# EAGLE design servo_1 (EAGLE 6.4)
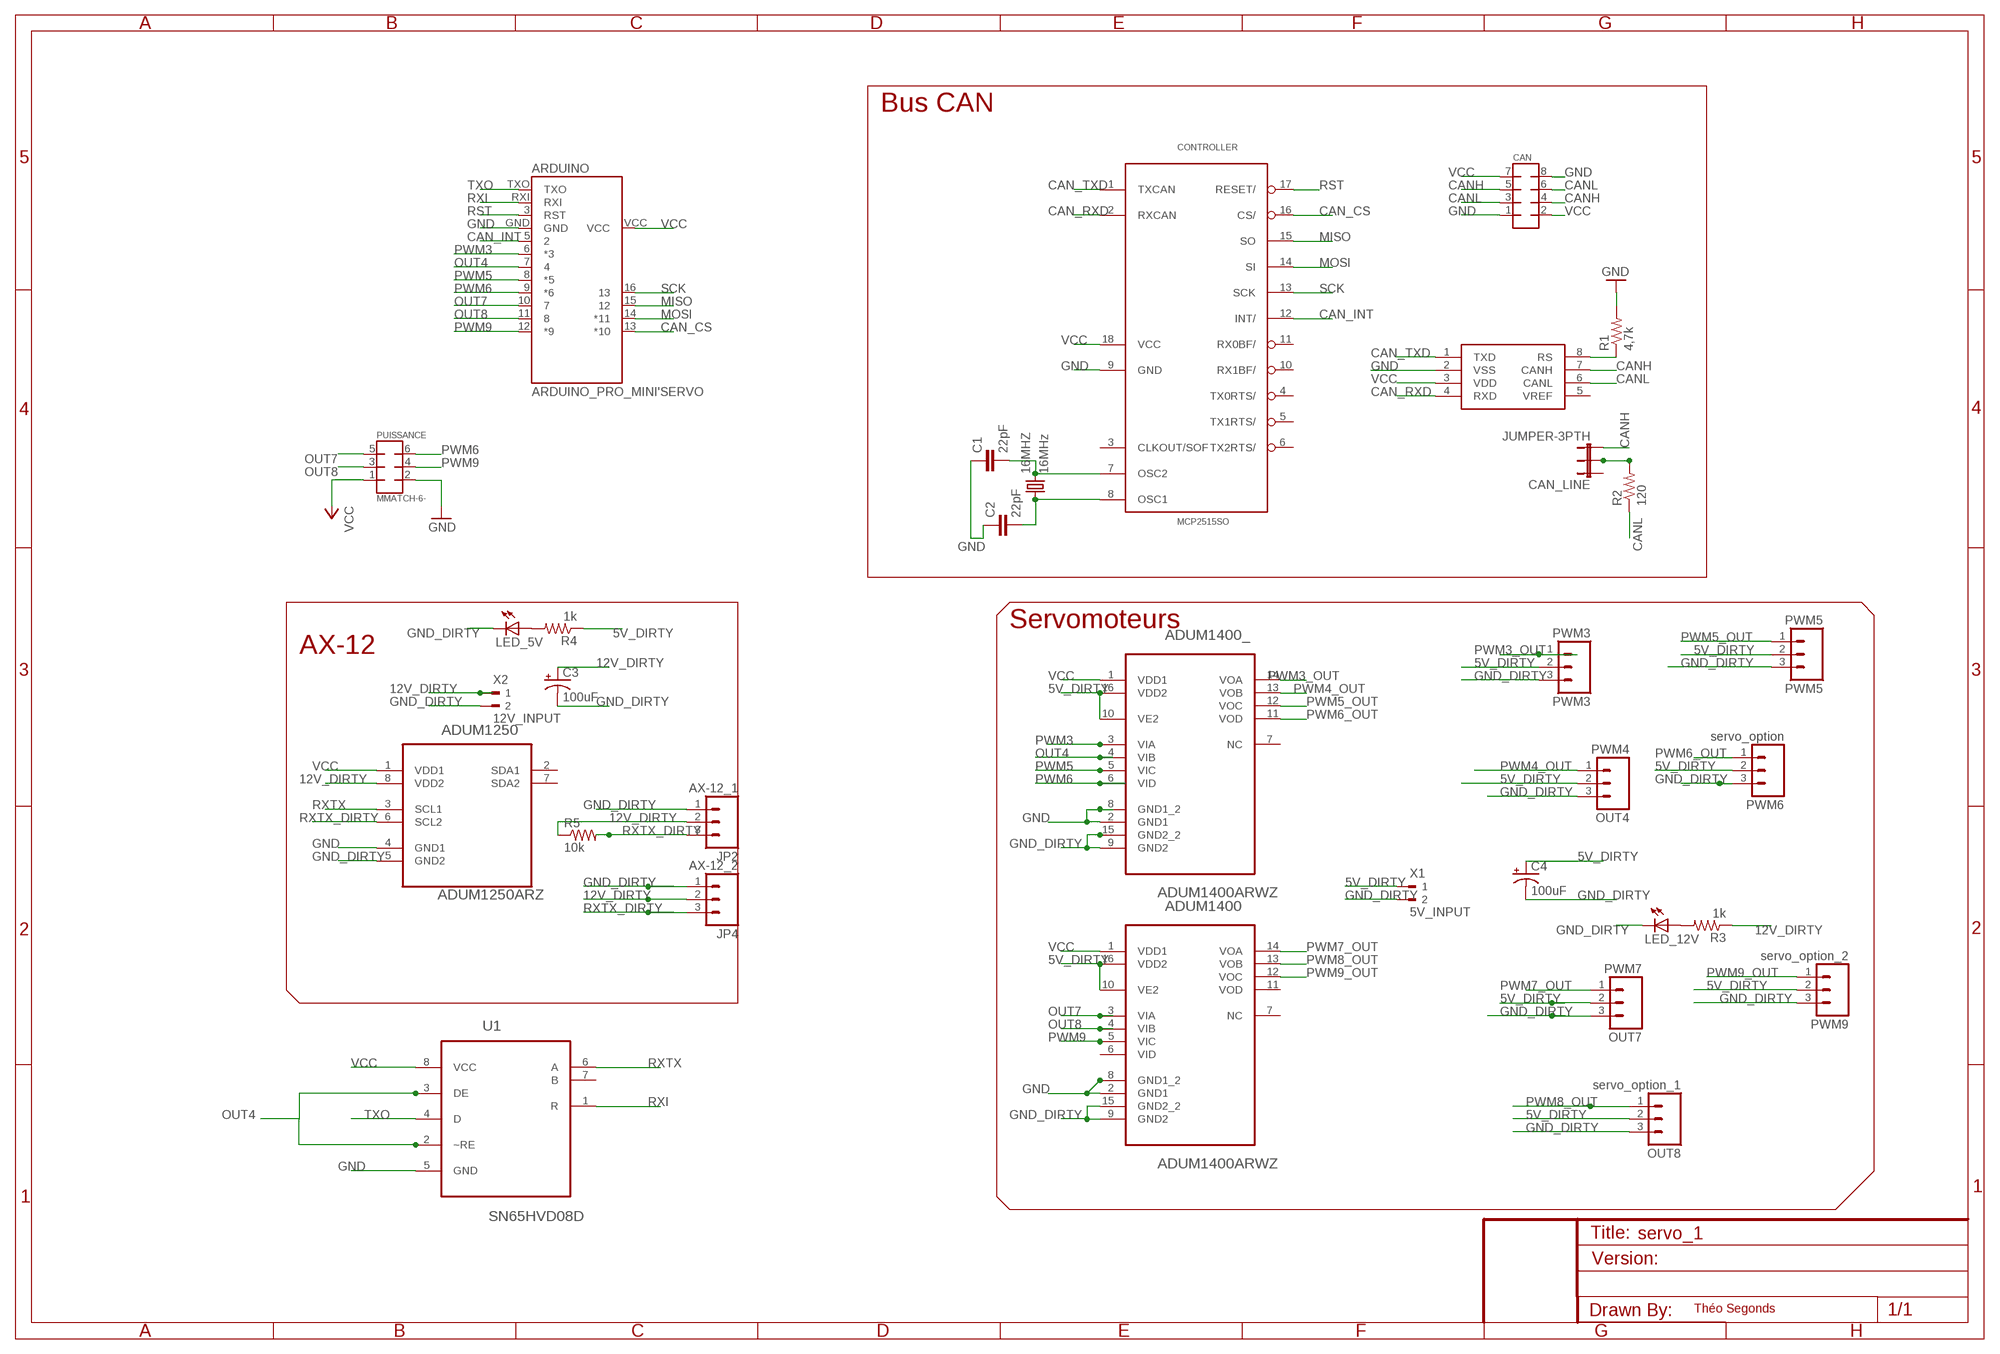
[diagram p0: schematic, sheet 1]

## Parts
16MHZ  16MHz  CRYSTALHC49S  [HC49/S]
ADUM1250  ADUM1250ARZ  [SOIC127P600X175-8N]
ADUM1400  ADUM1400ARWZ  [SOIC127P1032X265-16N]
ADUM1400_  ADUM1400ARWZ  [SOIC127P1032X265-16N]
ARDUINO  ARDUINO_PRO_MINI'SERVO  [ARDUINO_PRO_MINI]
C1  22pF  CAP0805  [0805]
C2  22pF  CAP0805  [0805]
C3  100uF  CAP_POLPTH1  [CPOL-RADIAL-100UF-25V]
C4  100uF  CAP_POLPTH1  [CPOL-RADIAL-100UF-25V]
CAN  MMATCH-8-PTH  [AMP-215079-8]
CAN_LINE  JUMPER-3PTH  [1X03]
CONTROLLER  MCP2515SO  [SO18L]
JP2  AX-12_1  M03POLAR  [MOLEX-1X3]
JP4  AX-12_2  M03POLAR  [MOLEX-1X3]
LED_5V  LEDCHIPLED_0805  [CHIPLED_0805]
LED_12V  LEDCHIPLED_0805  [CHIPLED_0805]
OUT4  PWM4  M03PTH  [1X03]
OUT7  PWM7  M03PTH  [1X03]
OUT8  servo_option_1  M03PTH  [1X03]
PUISSANCE  MMATCH-6-  [AMP-215079-6]
PWM3  PWM3  M03PTH  [1X03]
PWM5  PWM5  M03PTH  [1X03]
PWM6  servo_option  M03PTH  [1X03]
PWM9  servo_option_2  M03PTH  [1X03]
R1  4,7k  RESISTOR0805-RES  [0805]
R2  120  RESISTOR0805-RES  [0805]
R3  1k  RESISTOR0805-RES  [0805]
R4  1k  RESISTOR0805-RES  [0805]
R5  10k  RESISTOR0805-RES  [0805]
TRANSCEIVER  MCP2551  [SO08]
U1  SN65HVD08D  [SOIC127P600X175-8N]
X1  5V_INPUT  90-2  [90-2]
X2  12V_INPUT  90-2  [90-2]

## Nets
5V_DIRTY: ADUM1400.10(VE2) ADUM1400.16(VDD2) ADUM1400_.10(VE2) ADUM1400_.16(VDD2) C4.1(+) OUT4.2 OUT7.2 OUT8.2 PWM3.2 PWM5.2 PWM6.2 PWM9.2 R4.1 X1.1
12V_DIRTY: ADUM1250.8(VDD2) C3.1(+) JP2.2 JP4.2 R3.1 R5.1 X2.1
CAN_CS: ARDUINO.13(*10) CONTROLLER.16(CS/)
CAN_INT: ARDUINO.5 CONTROLLER.12(INT/)
CAN_RXD: CONTROLLER.2(RXCAN) TRANSCEIVER.4(RXD)
CAN_TXD: CONTROLLER.1(TXCAN) TRANSCEIVER.1(TXD)
CANH: CAN.4 CAN.5 CAN_LINE.3 TRANSCEIVER.7(CANH)
CANL: CAN.3 CAN.6 R2.1 TRANSCEIVER.6(CANL)
GND: ADUM1250.4(GND1) ADUM1400.2(GND1) ADUM1400.8(GND1_2) ADUM1400_.2(GND1) ADUM1400_.8(GND1_2) ARDUINO.GND C1.1 C2.1 CAN.1 CAN.8 CONTROLLER.9(GND) PUISSANCE.2 R1.2 TRANSCEIVER.2(VSS) U1.5(GND)
GND_DIRTY: ADUM1250.5(GND2) ADUM1400.9(GND2) ADUM1400.15(GND2_2) ADUM1400_.9(GND2) ADUM1400_.15(GND2_2) C3.2(-) C4.2(-) JP2.1 JP4.1 LED_5V.C LED_12V.C OUT4.3 OUT7.3 OUT8.3 PWM3.3 PWM5.3 PWM6.3 PWM9.3 X1.2 X2.2
MISO: ARDUINO.15 CONTROLLER.15(SO)
MOSI: ARDUINO.14(*11) CONTROLLER.14(SI)
N$2: 16MHZ.2 C1.2 CONTROLLER.7(OSC2)
N$3: 16MHZ.1 C2.2 CONTROLLER.8(OSC1)
N$4: LED_12V.A R3.2
N$5: R1.1 TRANSCEIVER.8(RS)
N$6: LED_5V.A R4.2
N$7: CAN_LINE.2 R2.2
OUT4: ADUM1400_.4(VIB) ARDUINO.7 U1.2(~RE) U1.3(DE)
OUT7: ADUM1400.3(VIA) ARDUINO.10 PUISSANCE.5
OUT8: ADUM1400.4(VIB) ARDUINO.11 PUISSANCE.3
PWM3: ADUM1400_.3(VIA) ARDUINO.6(*3)
PWM3_OUT: ADUM1400_.14(VOA) PWM3.1
PWM4_OUT: ADUM1400_.13(VOB) OUT4.1
PWM5: ADUM1400_.5(VIC) ARDUINO.8(*5)
PWM5_OUT: ADUM1400_.12(VOC) PWM5.1
PWM6: ADUM1400_.6(VID) ARDUINO.9(*6) PUISSANCE.6
PWM6_OUT: ADUM1400_.11(VOD) PWM6.1
PWM7_OUT: ADUM1400.14(VOA) OUT7.1
PWM8_OUT: ADUM1400.13(VOB) OUT8.1
PWM9: ADUM1400.5(VIC) ARDUINO.12(*9) PUISSANCE.4
PWM9_OUT: ADUM1400.12(VOC) PWM9.1
RST: ARDUINO.3(RST) CONTROLLER.17(RESET/)
RXI: ARDUINO.RXI U1.1(R)
RXTX: ADUM1250.3(SCL1) U1.6(A)
RXTX_DIRTY: ADUM1250.6(SCL2) JP2.3 JP4.3 R5.2
SCK: ARDUINO.16 CONTROLLER.13(SCK)
TXO: ARDUINO.TXO U1.4(D)
VCC: ADUM1250.1(VDD1) ADUM1400.1(VDD1) ADUM1400_.1(VDD1) ARDUINO.VCC CAN.2 CAN.7 CONTROLLER.18(VCC) PUISSANCE.1 TRANSCEIVER.3(VDD) U1.8(VCC)
Unconnected: ADUM1250.2(SDA1) ADUM1250.7(SDA2) ADUM1400.6(VID) ADUM1400.7(NC) ADUM1400.11(VOD) ADUM1400_.7(NC) CAN_LINE.1 CONTROLLER.3(CLKOUT/SOF) CONTROLLER.4(TX0RTS/) CONTROLLER.5(TX1RTS/) CONTROLLER.6(TX2RTS/) CONTROLLER.10(RX1BF/) CONTROLLER.11(RX0BF/) TRANSCEIVER.5(VREF) U1.7(B)

## Notes on the sheet
- Bus CAN
- Servomoteurs
- AX-12
- Théo Segonds

## Library data of the parts
16MHZ = adafruit:CRYSTAL: CRYSTAL; MF: MULTICOMP; MPN: HC49SM-3.6864-30-50-60-16-ATF; OC_FARNELL: 1667008; OC_NEWARK: unknown
ADUM1250 = Analog Devices_By_element14_Batch_1:ADUM1250ARZ: Hot Swappable, Dual I2C Isolators; MF: ANALOG DEVICES; MPN: ADUM1250ARZ; OC_FARNELL: 1814353; OC_NEWARK: 27M9880; PACKAGE: SOIC-8; SUPPLIER: Analog Devices
ADUM1400 ADUM1400_ = Analog Devices_By_element14_Batch_1:ADUM1400ARWZ: Quad-Channel Digital Isolators; MF: ANALOG DEVICES; MPN: ADUM1400ARWZ; OC_FARNELL: 1226217; OC_NEWARK: 19M8755; PACKAGE: SOIC-16; SUPPLIER: Analog Devices
ARDUINO = can_bus_servo:ARDUINO_PRO_MINI; OC_FARNELL: unknown
C1 C2 = SparkFun-Capacitors:CAP: Capacitor Standard 0603 ceramic capacitor, and 0.1" leaded capacitor.; MF: AVX; MPN: 08055A220JAT2A; OC_FARNELL: 2280675RL
C3 C4 = SparkFun-Capacitors:CAP_POL: Capacitor Polarized These are standard SMD and PTH capacitors. Normally 10uF, 47uF, and 100uF in electrolytic and tantalum varieties. Always verify the external diameter of the through hole cap, it varies with capacity, voltage, and manufacturer. The EIA devices should be standard.; MF: RUBYCON; MPN: 100TXW100MEFC8X30; OC_FARNELL: 2346289
CAN = jt-con-micromatch:MMATCH-8-*: AMP Micromatch 8-pin; OC_FARNELL: unknown
CAN_LINE = SparkFun-Passives:JUMPER-3
CONTROLLER = MCP2515_MT:MCP2515*: MCP2515 Standalone CAN-Controller by Microchip Eagle-Lib. by MartinThomas; OC_FARNELL: unknown
JP2 JP4 OUT4 OUT7 OUT8 PWM3 PWM5 PWM6 PWM9 = SparkFun-Connectors:M03: Header 3 Standard 3-pin 0.1" header. Use with straight break away headers (SKU : PRT-00116), right angle break away headers (PRT-00553), swiss pins (PRT-00743), machine pins (PRT-00117), and female headers (PRT-00115). Molex polarized connector foot print use with SKU : PRT-08232 with associated crimp pins and housings.; OC_FARNELL: unknown
LED_5V LED_12V = adafruit:LED: LED OSRAM: - CHIPLED LG R971, LG N971, LY N971, LG Q971, LY Q971, LO R971, LY R971 LH N974, LH R974 LS Q976, LO Q976, LY Q976 LO Q996 - Hyper CHIPLED LW Q18S LB Q993, LB Q99A, LB R99A - SideLED LS A670, LO A670, LY A670, LG A670, LP A670 LB A673, LV A673, LT A673, LW A673 LH A674 LY A675 LS A676, LA A676, LO A676, LY A676, LW A676 LS A679, LY A679, LG A679 - Hyper Micro SIDELED® LS Y876, LA Y876, LO Y876, LY Y876 LT Y87S - SmartLED LW L88C, LW L88S LB L89C, LB L89S, LG L890 LS L89K, LO L89K, LY L89K LS L896, LA L896, LO L896, LY L896 - TOPLED LS T670, LO T670, LY T670, LG T670, LP T670 LSG T670, LSP T670, LSY T670, LOP T670, LYG T670 LG T671, LOG T671, LSG T671 LB T673, LV T673, LT T673, LW T673 LH T674 LS T676, LA T676, LO T676, LY T676, LB T676, LH T676, LSB T676, LW T676 LB T67C, LV T67C, LT T67C, LS T67K, LO T67K, LY T67K, LW E67C LS E67B, LA E67B, LO E67B, LY E67B, LB E67C, LV E67C, LT E67C LW T67C LS T679, LY T679, LG T679 LS T770, LO T770, LY T770, LG T770, LP T770 LB T773, LV T773, LT T773, LW T773 LH T774 LS E675, LA E675, LY E675, LS T675 LS T776, LA T776, LO T776, LY T776, LB T776 LHGB T686 LT T68C, LB T68C - Hyper Mini TOPLED® LB M676 - Mini TOPLED Santana® LG M470 LS M47K, LO M47K, LY M47K Source: http://www.osram.convergy.de/
PUISSANCE = jt-con-micromatch:MMATCH-6-*
R1-R5 = SparkFun-Passives:RESISTOR: Resistor Basic schematic elements and footprints for 0603, 1206, and PTH resistors.; OC_FARNELL: unknown
TRANSCEIVER = SparkFun-DigitalIC:MCP2551: CAN transceiver; MF: MICROCHIP; MPN: MCP2551-I/SN...; OC_FARNELL: 2119745
U1 = Texas Instruments_By_element14_Batch_1:SN65HVD08D: WIDE SUPPLY RANGE RS-485 TRANSCEIVER; MPN: SN65HVD08D; OC_FARNELL: 1212360; OC_NEWARK: 17M9320; PACKAGE: SOIC-8; SUPPLIER: Texas Instruments
X1 X2 = con-weidmueller-sl35:90-2: WEIDMUELLER CLAMP CONNECTOR; OC_FARNELL: unknown; OC_NEWARK: unknown

## Net classes
0 default: clearance 0.205 mm

## Board
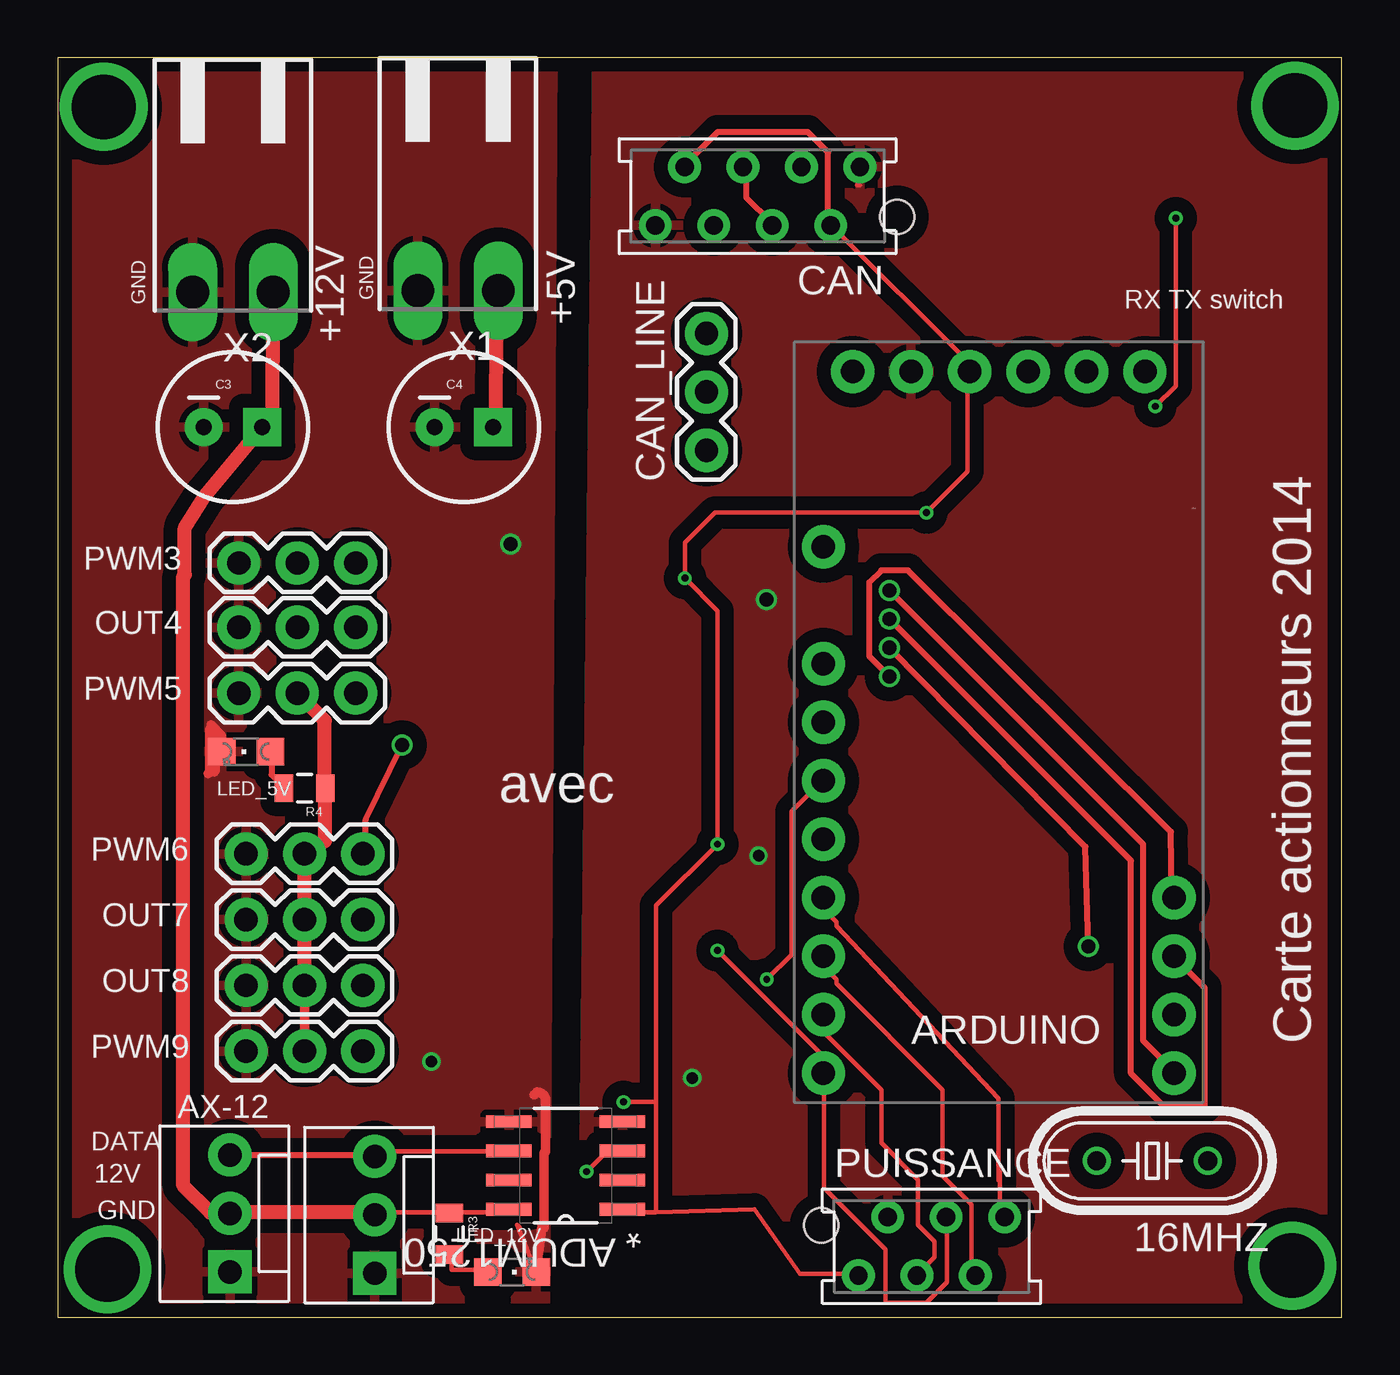
[diagram p1: board, top side]
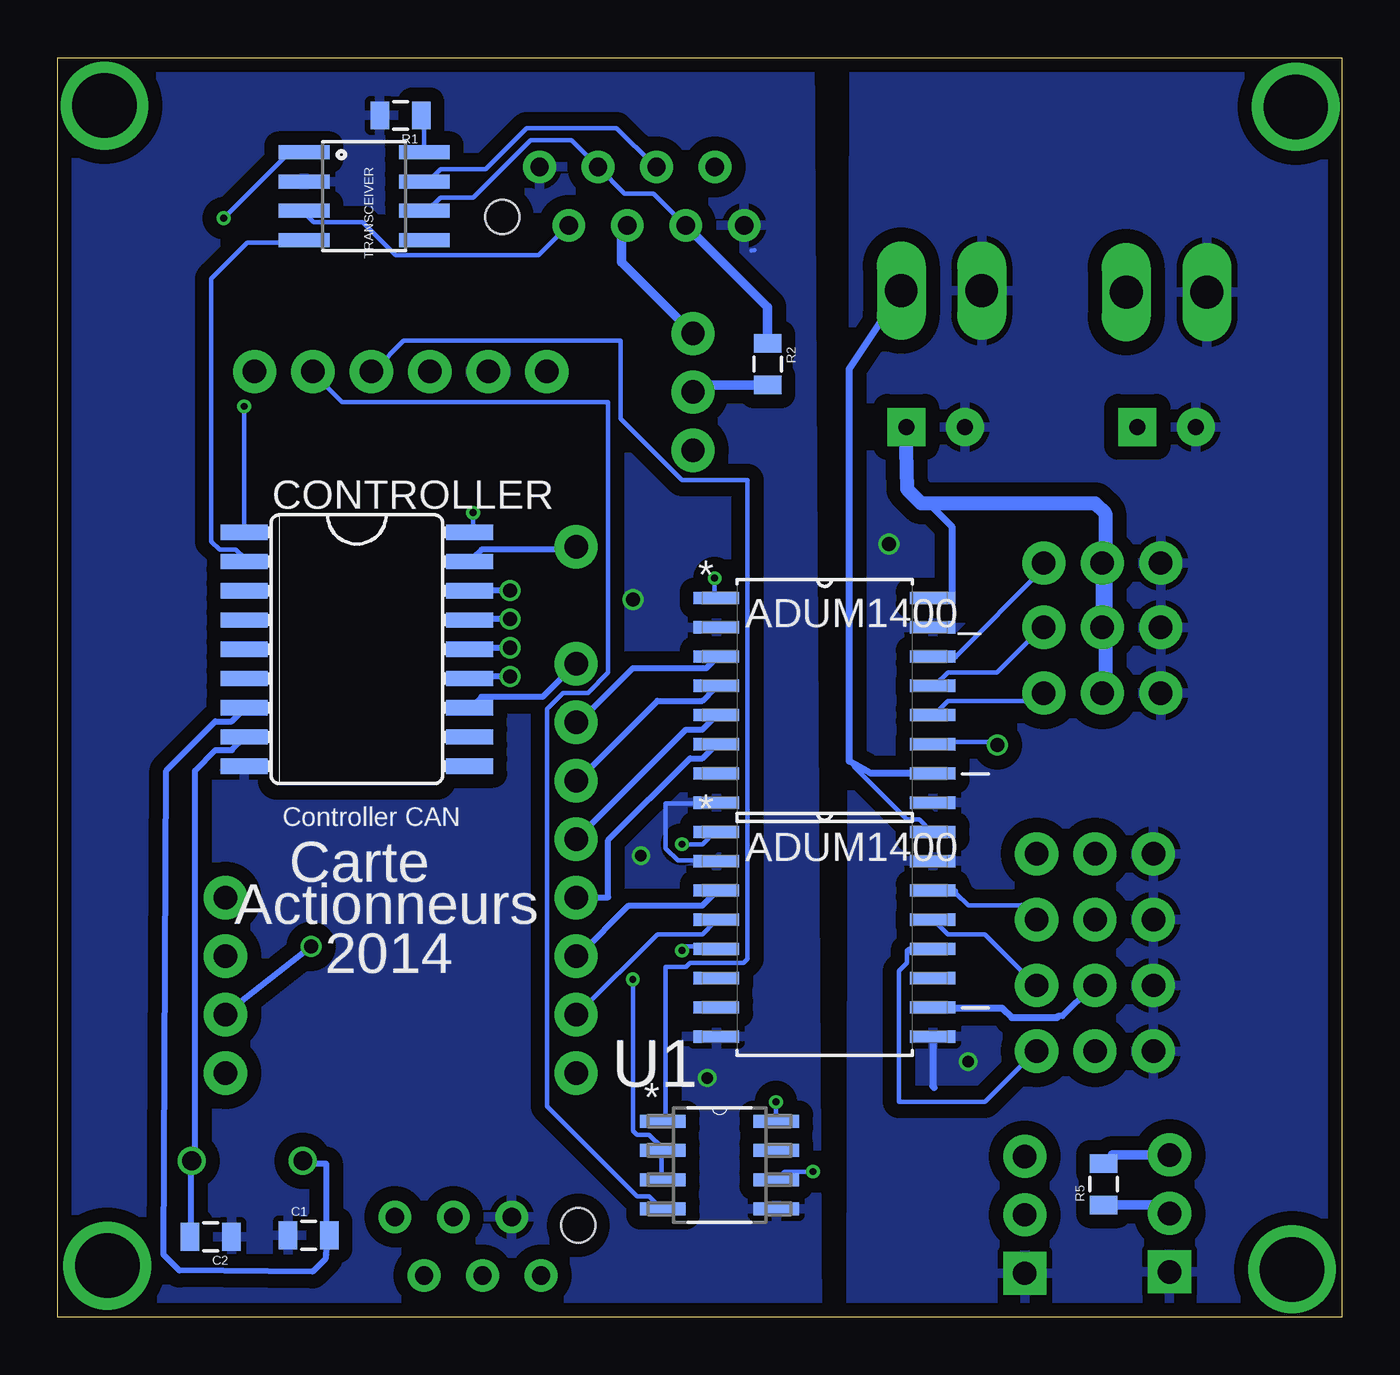
[diagram p2: board, bottom side, seen from below]

Size 55.8 x 54.73 mm. Coordinates in mm from the lower left corner, seen from the top.
Outline: 0,0 55.8,0 55.8,54.73 0,54.73 0,0
Copper layers (1*16): Top 0.035mm / dielectric 1.6mm / Bottom 0.035mm
Design rules "dipole": minimum track width 0.2mm, minimum drill 0.3mm, track to track 0.15mm, track to pad 0.15mm, pad to pad 0.15mm, via to via 0.15mm, smd to smd 0.01mm, copper to edge 0.01mm, drill to drill 0.01mm, minimum pad ring 0.15mm, minimum via ring 0.15mm, stop-mask expansion 1mil, vias tented up to drill 0mil, thermal gap 10mil
bRestrict: area 39.3,23.3 to 46.3,34.4

### Footprints (pad centres in the part's own frame; a part is rotated, then mirrored left to right if it is on the bottom)
HC49/S = drill 0.813: 1 -2.413,0; 2 2.413,0
SOIC127P600X175-8N = smd 1.981 x 0.559: 1 -2.464,1.905; 2 -2.464,0.635; 3 -2.464,-0.635; 4 -2.464,-1.905; 5 2.464,-1.905; 6 2.464,-0.635; 7 2.464,0.635; 8 2.464,1.905
SOIC127P1032X265-16N = smd 1.981 x 0.533: 1 -4.699,4.445; 2 -4.699,3.175; 3 -4.699,1.905; 4 -4.699,0.635; 5 -4.699,-0.635; 6 -4.699,-1.905; 7 -4.699,-3.175; 8 -4.699,-4.445; 9 4.699,-4.445; 10 4.699,-3.175; 11 4.699,-1.905; 12 4.699,-0.635; 13 4.699,0.635; 14 4.699,1.905; 15 4.699,3.175; 16 4.699,4.445
ARDUINO_PRO_MINI = drill 1.016 pad 1.88: 3 -7.62,7.62; 5 -7.62,2.54; 6 -7.62,0; 7 -7.62,-2.54; 8 -7.62,-5.08; 9 -7.62,-7.62; 10 -7.62,-10.16; 11 -7.62,-12.7; 12 -7.62,-15.24; 13 7.62,-15.24; 14 7.62,-12.7; 15 7.62,-10.16; 16 7.62,-7.62; BLK -6.35,15.24; GND -3.81,15.24; GRN 6.35,15.24; RXI 1.27,15.24; TXO 3.81,15.24; VCC -1.27,15.24
0805 = smd 0.8 x 1.2: 1 -0.9,0; 2 0.9,0
CPOL-RADIAL-100UF-25V = drill 0.7 pad 1.651 square: 1 1.27,0 | drill 0.7 pad 1.651: 2 -1.27,0
AMP-215079-8 = drill 0.8 pad 1.422: 1 0,-1.27; 2 1.27,1.27; 3 2.54,-1.27; 4 3.81,1.27; 5 5.08,-1.27; 6 6.35,1.27; 7 7.62,-1.27; 8 8.89,1.27 | hole 1.5: -1.62,0.905
1X03 = drill 1.016 pad 1.88: 1 0,0; 2 2.54,0; 3 5.08,0
SO18L = smd 0.66 x 2.032: 1 -5.08,-4.902; 2 -3.81,-4.902; 3 -2.54,-4.902; 4 -1.27,-4.902; 5 0,-4.902; 6 1.27,-4.902; 7 2.54,-4.902; 8 3.81,-4.902; 9 5.08,-4.902; 10 5.08,4.902; 11 3.81,4.902; 12 2.54,4.902; 13 1.27,4.902; 14 0,4.902; 15 -1.27,4.902; 16 -2.54,4.902; 17 -3.81,4.902; 18 -5.08,4.902
MOLEX-1X3 = drill 1.016 pad 1.88 square: 1 0,0 | drill 1.016 pad 1.88: 2 2.54,0; 3 5.08,0
CHIPLED_0805 = smd 1.2 x 1.2: A 0,-1.05; C 0,1.05
AMP-215079-6 = drill 0.8 pad 1.422: 1 0,0; 2 1.27,2.54; 3 2.54,0; 4 3.81,2.54; 5 5.08,0; 6 6.35,2.54 | hole 1.5: -1.62,2.175
SO08 = smd 0.61 x 2.21: 1 -1.905,-2.616; 2 -0.635,-2.616; 3 0.635,-2.616; 4 1.905,-2.616; 5 1.905,2.616; 6 0.635,2.616; 7 -0.635,2.616; 8 -1.905,2.616
90-2 = drill 1.422 long: 1 -1.75,5.25; 2 1.75,5.25

### Placement (x,y rotation side)
16MHZ  47.56,6.79 180 top
ADUM1250  22.08,6.59 180 top
ADUM1400  22.48,16.64 0 bottom
ADUM1400_  22.48,26.8 0 bottom
ARDUINO  40.89,25.84 0 top
C1  44.89,3.56 0 bottom
C2  49.15,3.49 180 bottom
C3  7.62,38.67 0 top
C4  17.65,38.67 0 top
CAN  34.86,48.7 180 top
CAN_LINE  28.19,37.66 90 top
CONTROLLER  42.8,29.02 270 bottom
JP2  13.78,1.91 90 top
JP4  7.49,1.97 90 top
LED_5V  8.19,24.57 90 top
LED_12V  19.74,1.97 270 top
OUT4  12.95,29.97 180 top
OUT7  13.27,17.27 180 top
OUT8  13.27,14.41 180 top
PUISSANCE  34.8,1.81 0 top
PWM3  12.95,32.77 180 top
PWM5  12.95,27.11 180 top
PWM6  13.27,20.13 180 top
PWM9  13.27,11.56 180 top
R1  40.9,52.21 180 bottom
R2  24.96,41.4 270 bottom
R3  17.02,3.63 270 top
R4  10.73,22.99 180 top
R5  10.35,5.78 90 bottom
TRANSCEIVER  42.48,48.7 270 bottom
U1  27.04,6.61 0 bottom
X1  17.4,49.85 180 top
X2  7.62,49.78 180 top

### Tracks (layer width: path | path; a pad name or v marks a point on that pad's centre or on a via)
5V_DIRTY
  Top 0.254: 19.08,43.31 X1.1 | 11.61,22.86 R4.1 11.61,23.04 | 10.9,19.84 PWM6.2 10.72,19.66 | 10.72,17.35 OUT7.2 10.72,17.17 | 10.54,26.95 PWM5.2 | 10.72,14.5 OUT8.2
  Top 0.406: 10.72,14.69 arc-5 10.8,14.41 10.8,14.61 10.73,14.67 10.73,11.62 10.8,11.56 PWM9.2 10.67,11.49
  Top 0.61: PWM5.2 11.61,25.92 11.61,22.86 11.61,20.69 PWM6.2 | 10.72,19.66 10.72,17.29 OUT7.2 | 10.72,17.17 10.72,14.69 10.72,14.43 OUT8.2 | 19.08,43.31 19.01,38.7 C4.1
  Bottom 0.2: ADUM1400.16 17.83,21.08 18.36,21.61 18.9,21.61 21.21,23.93 21.16,24.01
  Bottom 0.254: 17.83,31.39 ADUM1400_.16 | 18.96,38.53 C4.1 | 12.32,13.08 12.14,13.08 10.9,14.33 OUT8.2 | 10.9,11.66 PWM9.2 | 10.9,19.84 PWM6.2 | 17.65,13.44 ADUM1400.10
  Bottom 0.305: 17.65,13.44 14.77,13.44 14.35,13.02 12.38,13.02 12.32,13.08 | ADUM1400_.10 20.48,23.62 21.16,24.01 21.4,24.15 21.4,41.2 X1.1 | 18.29,35.37 17.97,35.37 16.95,34.35 16.95,31.31 17.08,31.18 17.72,31.18 ADUM1400_.16
  Bottom 0.61: 18.96,38.53 18.9,35.98 18.29,35.37 10.73,35.37 10.29,34.92 10.29,32.64 | 10.29,32.64 10.29,27.24 PWM5.2 | 10.29,32.64 PWM3.2 OUT4.2
12V_DIRTY
  Top 0.2: ADUM1250.8 19.61,4.55 17.12,4.55 R3.1 16.94,4.55 13.92,4.55 JP2.2
  Top 0.254: 7.52,4.55 JP4.2 7.34,4.55 | 13.74,4.55 JP2.2
  Top 0.61: X2.1 9.31,38.39 C3.1 6.41,35.69 5.52,34.29 5.52,32.26 5.46,32.19 5.46,5.71 6.63,4.55 7.53,4.55 | 13.74,4.55 7.53,4.55 | 7.53,4.55 JP4.2
  Bottom 0.406: R5.1 7.86,4.88 JP4.2
CAN_CS  (via drill 0.61)
  Top 0.254: v36.14,31.57 47.17,20.55 47.17,12.01 48.41,10.77 ARDUINO.13
  Bottom 0.254: v36.14,31.57 37.74,31.57 CONTROLLER.16
CAN_INT
  Bottom 0.254: CONTROLLER.12 37.74,26.59 37.39,26.95 34.72,26.95 33.3,28.37 ARDUINO.5
CAN_RXD
  Bottom 0.2: CONTROLLER.2 47.7,33 48.06,33.35 48.77,33.35 49.12,33.71 49.12,45.12 47.56,46.69 45.21,46.69 TRANSCEIVER.4
CAN_TXD  (via drill 0.3)
  Top 0.2: v47.7,39.57 48.59,40.46 v48.59,47.75
  Bottom 0.2: v47.7,39.57 CONTROLLER.1 | v48.59,47.75 45.74,50.6 45.21,50.6 TRANSCEIVER.1
CANH
  Top 0.254: CAN.4 30.99,47.57 29.92,48.64 29.92,49.89 CAN.5
  Bottom 0.2: TRANSCEIVER.7 39.7,49.35 39.17,49.89 37.21,49.89 35.43,51.66 31.52,51.66 29.92,50.06 CAN.5
  Bottom 0.406: CAN_LINE.3 31.31,45.85 31.31,47.18 CAN.4
CANL
  Bottom 0.2: TRANSCEIVER.6 39.7,48.11 39.17,48.64 37.74,48.64 35.26,51.13 33.48,51.13 CAN.3 31.17,48.82 29.92,48.82 28.68,47.57 CAN.6
  Bottom 0.406: R2.1 24.96,43.88 CAN.6
GND  (via drill 0.5, 0.6)
  Top 0.2: 34.72,49.17 34.86,49.17
  Bottom 0.2: ADUM1400.2 27.25,19.84 28.85,19.84 29.39,20.37 29.39,22.33 27.25,22.33 ADUM1400_.8 | 25.65,46.33 25.52,46.35
  other vias: 30.8,31.18 27.57,10.4 30.45,20.05
  pour Bottom (isolate 0.61): 22.8,-0.19 54.86,0.76 56.13,0.76 56.13,54.74 23.11,55.37
  pour Top (isolate 0.61): 22.8,0.13 55.82,0.76 55.5,54.74 23.43,55.05
GND_DIRTY  (via drill 0.5, 0.6)
  Top 0.2: 8.23,17.35 OUT7.3 | LED_12V.C 19.96,4.01 20.1,3.87
  Top 0.406: LED_5V.C 7.14,25.24 6.67,25.72 6.67,23.81 6.79,23.68 6.86,23.75 6.86,25.27 6.6,25.53 6.6,23.68 6.54,23.62 | 20.7,9.65 20.83,9.78 arc-90 21.21,9.4 21.21,7.18 arc90 21.15,7.11 21.15,3.87 arc90 21.05,3.97 LED_12V.C
  Bottom 0.305: ADUM1400.9 17.78,10.03 17.72,9.97
  other vias: 19.69,33.59 16.25,11.11
  pour Bottom (isolate 0.61): -0.83,55.25 -2.86,-0.7 21.33,-0.05 21.21,55.05 13.4,55.18
  pour Top (isolate 0.61): -2.79,-0.44 21.21,-0.06 21.53,55.05 -0.76,55.31
MISO  (via drill 0.61)
  Top 0.254: v36.14,30.33 46.63,19.84 46.63,10.59 48.06,9.17 49.84,9.17 49.84,14.33 48.59,15.57 ARDUINO.15
  Bottom 0.254: v36.14,30.33 37.74,30.33 CONTROLLER.15
MOSI  (via drill 0.61)
  Top 0.254: v36.14,29.08 44.67,20.43 v44.79,16.12
  Bottom 0.254: v36.14,29.08 37.74,29.08 CONTROLLER.14 | v44.79,16.12 48.41,13.26 ARDUINO.14
N$1
  Bottom 0.406: 17.72,23.62 18.03,23.62
N$2
  Bottom 0.254: 44.86,6.68 45.03,6.68 16MHZ.2 44.86,6.68 | 44.86,6.68 44.15,6.68 44.15,3.66 C1.2 44.13,2.73 44.14,2.58 44.16,2.54 44.72,1.97 50.52,2.03 51.2,2.72 51.08,23.75 48.95,25.88 48.24,25.88 47.7,26.42 CONTROLLER.7
N$3
  Bottom 0.254: C2.2 50.01,3.66 50.01,6.68 16MHZ.1 49.84,6.86 49.84,23.75 48.95,24.64 48.24,24.64 47.7,25.17 CONTROLLER.8
N$4
  Top 0.2: LED_12V.A 18.54,2.06 17.12,2.06 17.12,2.59 R3.2
N$5
  Bottom 0.2: R1.1 39.88,52.2 39.88,50.78 TRANSCEIVER.8
N$6
  Top 0.254: R4.2 9.83,23.04 9.3,23.57 9.3,24.46 LED_5V.A
N$7
  Bottom 0.406: R2.2 27.89,40.5 CAN_LINE.2
N$8  (via drill 2.8)
  other vias: 53.76,52.64
N$9  (via drill 2.8)
  other vias: 2.01,52.59
N$10  (via drill 2.8)
  other vias: 2.17,2.08
N$12  (via drill 2.8)
  other vias: 53.64,2.24
OUT4  (via drill 0.3)
  Top 0.2: v30.81,14.68 31.88,15.75 31.88,21.97 33.12,23.22 ARDUINO.7
  Bottom 0.2: 33.12,23.39 ARDUINO.7 | U1.3 29.57,6.15 29.57,7.21 U1.2 29.57,7.39 30.1,7.93 30.63,7.93 30.81,8.1 v30.81,14.68
  Bottom 0.254: 33.12,23.39 29.74,26.77 27.79,26.77 27.25,27.31 ADUM1400_.4
OUT7
  Top 0.2: PUISSANCE.5 39.88,1.88 39.7,2.06 39.7,4.9 38.46,6.15 38.46,9.88 33.83,14.5 33.83,14.68 33.3,15.21 33.3,15.57 ARDUINO.10
  Bottom 0.2: 33.12,15.75 ARDUINO.10
  Bottom 0.254: 33.12,15.75 30.99,17.88 27.79,17.88 27.25,18.42 ADUM1400.3
OUT8
  Top 0.2: PUISSANCE.3 37.39,1.88 38.1,2.59 38.1,3.3 37.39,4.01 37.39,5.97 35.79,7.57 35.79,9.88 33.3,12.37 33.3,13.08 ARDUINO.11
  Bottom 0.2: ADUM1400.4 27.25,17.17 27.79,16.64 29.74,16.64 33.12,13.26 ARDUINO.11
PWM3
  Bottom 0.254: ADUM1400_.3 27.25,28.55 27.61,28.19 30.81,28.19 33.12,25.88 ARDUINO.6
PWM3_OUT
  Bottom 0.2: 13.03,32.46 16.8,28.69
  Bottom 0.254: 16.8,28.69 17.65,28.73 ADUM1400_.14 | 13.03,32.46 PWM3.1
PWM4_OUT
  Bottom 0.2: ADUM1400_.13 17.65,27.48 17.12,28.02 14.99,28.02 13.03,29.97 OUT4.1
PWM5
  Bottom 0.254: ADUM1400_.5 27.25,26.06 27.79,25.53 28.5,25.53 33.12,20.9 ARDUINO.8
PWM5_OUT
  Bottom 0.2: ADUM1400_.12 17.65,26.24 17.12,26.77 13.21,26.77 13.03,26.95 PWM5.1
PWM6
  Top 0.2: PUISSANCE.6 41.12,4.37 40.95,4.55 40.95,6.33 40.87,5.95 40.87,9.51 33.83,16.99 33.83,17.17 33.3,17.7 33.3,18.06 ARDUINO.9
  Bottom 0.254: ADUM1400_.6 27.79,24.28 28.32,24.28 31.88,20.73 31.88,18.24 33.12,18.24 ARDUINO.9
PWM6_OUT  (via drill 0.61)
  Top 0.254: v14.97,24.85 13.39,21.61 13.39,19.84 PWM6.1
  Bottom 0.2: ADUM1400_.11 16.94,24.99 14.99,24.99 v14.97,24.85
  Bottom 0.254: 16.99,24.92 17.65,24.82 ADUM1400_.11
PWM7_OUT
  Bottom 0.2: 16.8,18.52 16.76,18.42 16.23,17.88 13.92,17.88 OUT7.1
  Bottom 0.254: 16.8,18.52 ADUM1400.14 | 13.92,17.88 13.39,17.35 OUT7.1
PWM8_OUT
  Bottom 0.2: ADUM1400.13 17.65,17.17 17.12,16.64 15.52,16.64 13.39,14.5 OUT8.1
PWM9  (via drill 0.3)
  Top 0.2: v28.68,15.93 33.12,11.48 33.12,10.77 ARDUINO.12 33.3,10.59 33.3,5.61 35.97,2.95 35.97,0.64 37.74,0.64 38.63,1.52 38.63,4.19 PUISSANCE.4
  Bottom 0.2: v28.68,15.93 28.5,16.1 27.25,16.1 ADUM1400.5
PWM9_OUT
  Bottom 0.2: 13.39,11.48 15.52,9.35 19.25,9.35 19.25,15.04 18.9,15.39 18.9,15.93 18.81,15.96
  Bottom 0.254: 18.81,15.96 17.83,15.93 ADUM1400.12 | 13.39,11.48 PWM9.1
RST
  Bottom 0.254: CONTROLLER.17 37.74,33 37.39,33.35 33.3,33.35 ARDUINO.3
RXI
  Top 0.254: 42.01,41.17 ARDUINO.RXI
  Bottom 0.2: U1.1 29.39,8.64 29.39,15.21 28.5,15.21 28.32,15.39 26.01,15.39 25.83,15.57 25.83,36.37 28.68,36.37 31.34,39.04 31.34,42.42 40.77,42.42 42.01,41.17 ARDUINO.RXI
RXTX  (via drill 0.3)
  Top 0.2: v22.99,6.33 23.88,7.21 24.41,7.21 ADUM1250.3
  Bottom 0.2: v22.99,6.33 24.23,6.33 24.41,6.15 U1.6
RXTX_DIRTY
  Top 0.2: 13.74,7.04 JP2.3 13.92,7.04 13.92,7.21 18.9,7.21 ADUM1250.6
  Top 0.254: 13.74,7.04 7.52,7.04 JP4.3
  Bottom 0.2: R5.2 10.19,6.68 10.01,6.86 9.98,7.05
  Bottom 0.406: JP4.3 9.98,7.05
SCK  (via drill 0.61)
  Top 0.254: v36.14,27.84 35.26,28.73 35.26,31.93 35.79,32.45 36.95,32.44 48.38,21.08 48.41,18.24 ARDUINO.16
  Bottom 0.254: v36.14,27.84 37.74,27.84 CONTROLLER.13
TXO
  Top 0.254: 44.68,41.17 ARDUINO.TXO
  Bottom 0.2: U1.4 29.57,4.72 30.1,5.26 30.63,5.26 34.54,9.17 34.54,26.42 33.83,27.13 32.77,27.13 31.88,28.02 31.88,39.75 43.43,39.75 44.68,41 ARDUINO.TXO
VCC  (via drill 0.3)
  Top 0.2: 26.01,4.55 30.28,4.69 32.25,1.88 34.72,1.88 PUISSANCE.1 | 26.01,4.55 24.59,4.55 ADUM1250.1 | 26.01,9.35 v24.59,9.35 | 26.01,4.55 26.01,9.35 | 26.01,9.35 26.01,17.88 v28.68,20.55 28.68,30.68 v27.25,32.11 27.25,33.64 28.56,34.95 v37.74,34.95 39.52,36.73 39.52,41 ARDUINO.VCC 39.52,41.17 39.52,41.53 33.66,47.4 CAN.2
  Top 0.254: CAN.7 27.25,50.06 28.68,51.49 32.6,51.49 33.48,50.61 33.48,47.57 CAN.2
  Bottom 0.2: v37.74,34.95 37.74,34.24 CONTROLLER.18 | v24.59,9.35 24.59,8.64 U1.8 | v28.68,20.55 27.79,20.55 27.25,21.08 ADUM1400.1 | v27.25,32.11 27.25,31.39 ADUM1400_.1 | TRANSCEIVER.3 45.03,47.93 44.68,47.57 42.55,47.57 41.12,46.15 34.9,46.15 33.66,47.4 CAN.2

### Text on the board
tNames: GND | GND | RX TX switch | +12V | +5V | 2014 | avec | Carte actionneurs 2014 | AX-12 | DATA | 12V | GND
bNames: Controller CAN | Carte | Actionneurs | 2014
200bmp: /home/showok/Documents/Projets/Ares/Robot-2013-2014/cartes/logo_ares_3.bmp